# EAGLE schematic RelayBoard (EAGLE 9.0.0)
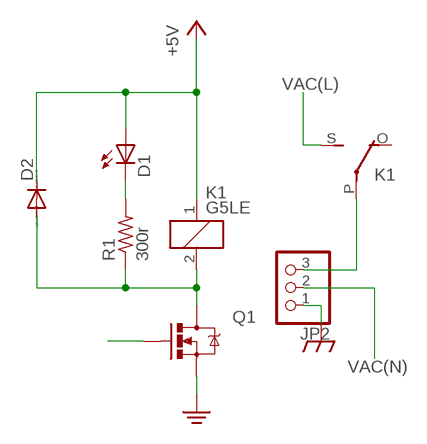
[diagram p0: schematic, sheet 1]

## Parts
D1  U57X32  [U57X32]
D2  1N4004  [DO41-10]
JP2  PINHD-1X3  [1X03]
K1  G5LE  [G5LE]
Q1  MOSFET-NCHANNELSMD  [SOT23-3]
R1  300r  R-US_R0603  [R0603]

## Nets
+5V: D1.A D2.C K1.1
N$1: D2.A K1.2 Q1.3(D) R1.1
N$2: D1.K(C) R1.2
N$4: JP2.3 K1.P(2:P)
N$5: Q1.1(G)
PE: Q1.2(S)
PGND: JP2.1
VAC(L): K1.S(2:S)
VAC(N): JP2.2
Unconnected: K1.O(2:O)

## Library data of the parts
D1 = led:U57X32: LED rectangle, 5.7 x 3.2 mm
D2 = diode:1N4004: DIODE general purpose rectifier, 1 A
JP2 = pinhead:PINHD-1X3: PIN HEADER
K1 = relay:G5LE: RELAY 1 x switch, 10 A/120 V AC, 8 A/30 V DC, Omron; OC_FARNELL: unknown; OC_NEWARK: unknown
Q1 = fets:MOSFET-NCHANNEL: Generic NMOS footprint
R1 = rcl:R-US_: RESISTOR, American symbol; SPICEPREFIX: R

## Net classes
0 default: width 0.254 mm, drill 0.254 mm, clearance 0.762 mm